# Altium schematic sheet CableDebugger.SchDoc
size A4; PageSetup: Record=PageOptions|CenterHorizontal=True|CenterVertical=True|PrintScale=1.00|XCorrection=1.00|YCorrection=1.00|PrintKind=0|BorderSize=5000000|LeftOffset=0|BottomOffset=0|Orientation=2|PaperLength=1000|PaperWidth=1000|Scale=100|PaperSource=7|PrintQuality=-3|MediaType=1|DitherType=10|PrintScaleMode=1|PaperKind=A4|PaperIndex=9
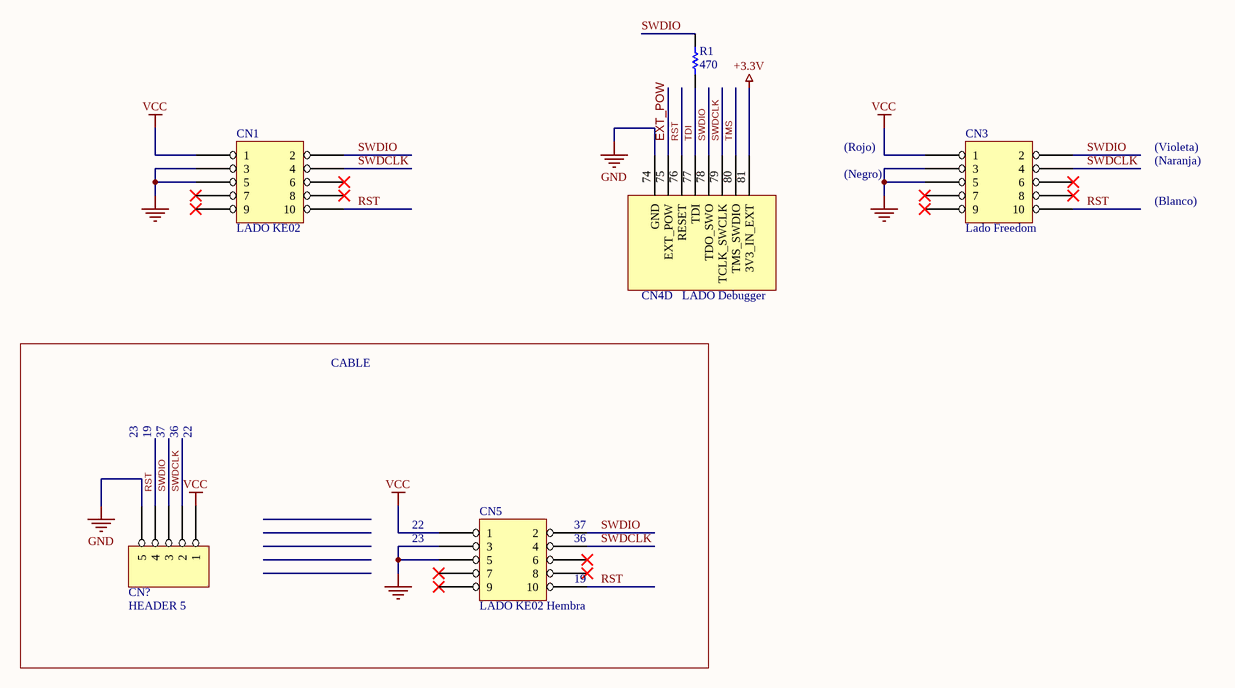
[diagram p0: CableDebugger.SchDoc]

## Parts
CN1  LADO KE02  [SIP2X5]
CN3  Lado Freedom  [SIP2X5]
CN4  LADO Debugger  (part D of 4)
CN5  LADO KE02 Hembra  [SIP2X5]
CN?  HEADER 5  [SIP5]
R1  470  [R-0805_N]

## Nets
+3.3V: CN4.81(3V3_IN_EXT)
GND: CN1.3 CN1.5 CN3.3 CN3.5 CN4.74(GND) CN5.3 CN5.5 CN?.5
VCC: CN1.1 CN3.1 CN5.1 CN?.1
EXT_POW: CN4.75(EXT_POW)
RST: CN1.10 CN3.10 CN4.76(RESET) CN5.10 CN?.4
SWDCLK: CN1.4 CN3.4 CN4.79(TCLK_SWCLK) CN5.4 CN?.2
SWDIO: CN1.2 CN3.2 CN4.78(TDO_SWO) CN5.2 CN?.3 R1.2
TDI: CN4.77(TDI) R1.1
TMS: CN4.80(TMS_SWDIO)

Not connected (* = marked no-connect by the designer): CN1 6* 7* 8* 9*; CN3 6* 7* 8* 9*; CN5 6* 7* 8* 9*

## Notes on the sheet
- (Rojo)
- (Violeta)
- (Negro)
- (Naranja)
- (Blanco)
- CABLE
- 23
- 19
- 37
- 36
- 22
- (near CN5) 37
- (near CN5) 36
- (near CN5) 19

## Library data of the parts
CN1 CN3 CN5 = HEADER 5X2
CN4 = LPC1769 BOARD
R1 = RES1: Resistor; Value: 1k; Published: 8-Jun-2000; LatestRevisionDate: 17-Jul-2002; LatestRevisionNote: Re-released for DXP Platform.; PackageReference: AXIAL-0.3; Publisher: Altium Limited; PackageDescription: Axial Device, Thru-Hole; 2 Leads; 0.3 in Pin Spacing; Price: 0,03